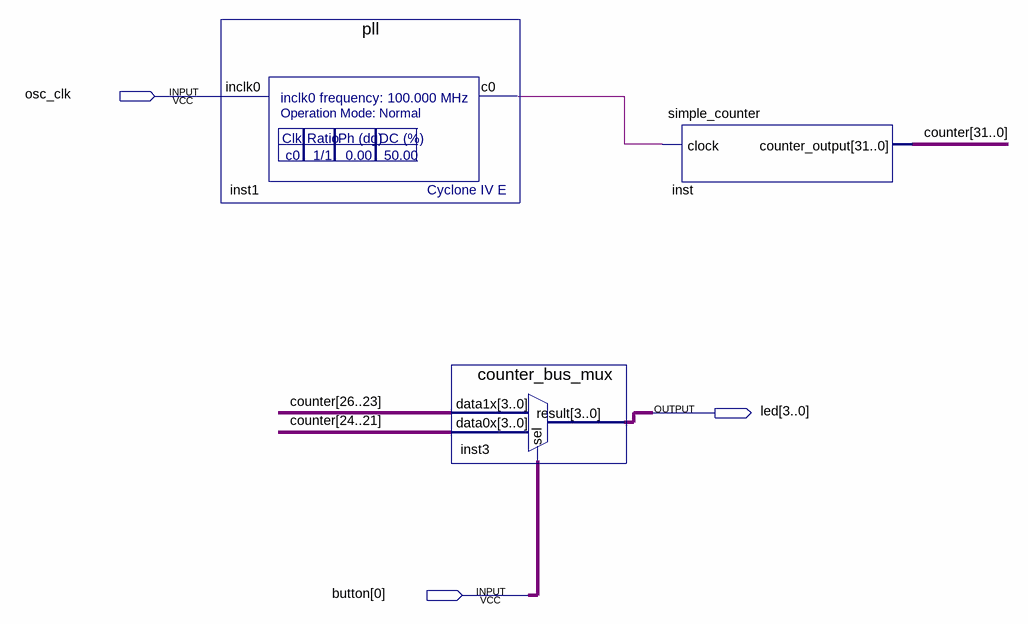
[diagram p0: schematic sheet]
// Quartus schematic Blinky.bdf as structural Verilog: 3 symbols, 3 pins
module Blinky (
  input  osc_clk,
  input  [0:0] button,
  output [3:0] led
);

  wire inst1_c0;
  wire [31:0] counter;

  pll inst1 (.inclk0(osc_clk), .c0(inst1_c0));
  counter_bus_mux inst3 (.data1x(counter[26:23]), .data0x(counter[24:21]), .sel(button[0]), .result(led));
  simple_counter inst (.clock(inst1_c0), .counter_output(counter));
endmodule
